# EAGLE design brewBuddy (EAGLE 7.5.0)
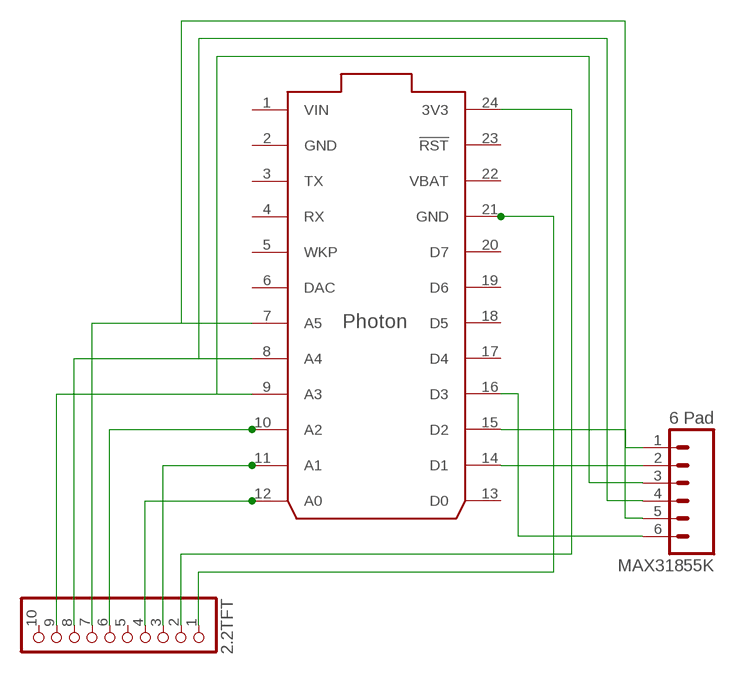
[diagram p0: schematic, sheet 1]

## Parts
2.2TFT  MICROBUILDER_HEADER-1X101X10_2MM  [MICROBUILDER_1X10_ROUND_2MM]
MAX31855K  6 Pad  M06LONGPADS  [1X06_LONGPADS]
U$1  PHOTON_WITH_HEADERS  [PHOTON]

## Nets
N$1: MAX31855K.1 U$1.15(D2)
N$2: MAX31855K.2 U$1.14(D1)
N$3: MAX31855K.6 U$1.16(D3)
N$4: 2.2TFT.9 MAX31855K.3 U$1.9(A3)
N$5: 2.2TFT.8 MAX31855K.4 U$1.8(A4)
N$6: 2.2TFT.7 MAX31855K.5 U$1.7(A5)
N$9: 2.2TFT.6 U$1.10(A2)
N$10: 2.2TFT.4 U$1.12(A0)
N$11: 2.2TFT.3 U$1.11(A1)
N$12: 2.2TFT.2 U$1.24(3V3)
N$13: 2.2TFT.1 U$1.21(GND)
Unconnected: 2.2TFT.5 2.2TFT.10 U$1.3(TX) U$1.4(RX) U$1.5(WKP) U$1.6(DAC) U$1.13(D0) U$1.17(D4) U$1.18(D5) U$1.19(D6) U$1.20(D7) U$1.23(!RST)

## Power pins joined to a net without a drawn wire
GND: U$1.2(GND)
VBAT: U$1.22(VBAT)
VIN: U$1.1(VIN)

## Library data of the parts
2.2TFT = Adafruit_2.2_SPI_240x320:MICROBUILDER_HEADER-1X10: PIN HEADER
MAX31855K = SparkFun_Thermocouple_Breakout:M06: Header 6 Standard 6-pin 0.1" header. Use with straight break away headers (SKU : PRT-00116), right angle break away headers (PRT-00553), swiss pins (PRT-00743), machine pins (PRT-00117), and female headers (PRT-00115). Molex polarized connector foot print use with SKU : PRT-08094 with associated crimp pins and housings. NOTES ON THE VARIANTS LOCK and LOCK_LONGPADS... This footprint was designed to help hold the alignment of a through-hole component (i.e. 6-pin header) while soldering it into place. You may notice that each hole has been shifted either up or down by 0.005 of an inch from it's more standard position (which is a perfectly straight line). This slight alteration caused the pins (the squares in the middle) to touch the edges of the holes. Because they are alternating, it causes a "brace" to hold the component in place. 0.005 has proven to be the perfect amount of "off-center" position when using our standard breakaway headers. Although looks a little odd when you look at the bare footprint, once you have a header in there, the alteration is very hard to notice. Also,if you push a header all the way into place, it is covered up entirely on the bottom side. This idea of altering the position of holes to aid alignment will be further integrated into the Sparkfun Library for other footprints. It can help hold any component with 3 or more connection pins.
U$1 = Spark:PHOTON

## Board
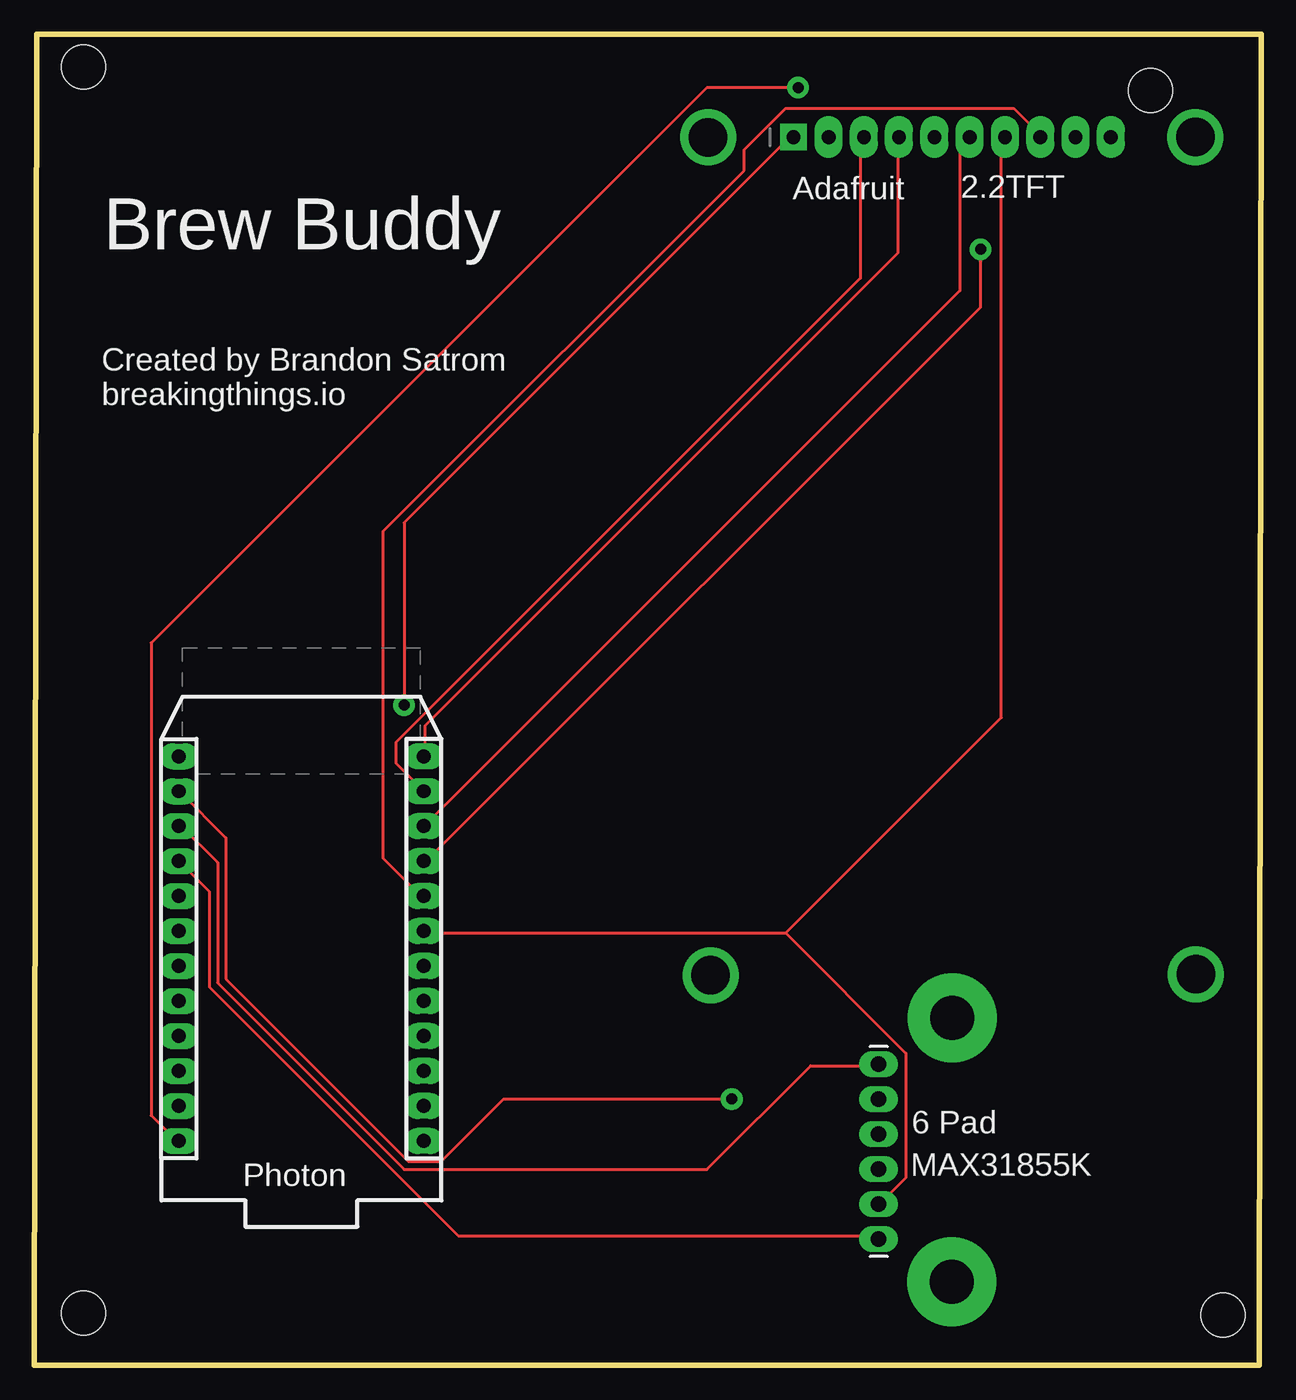
[diagram p1: board, top side]
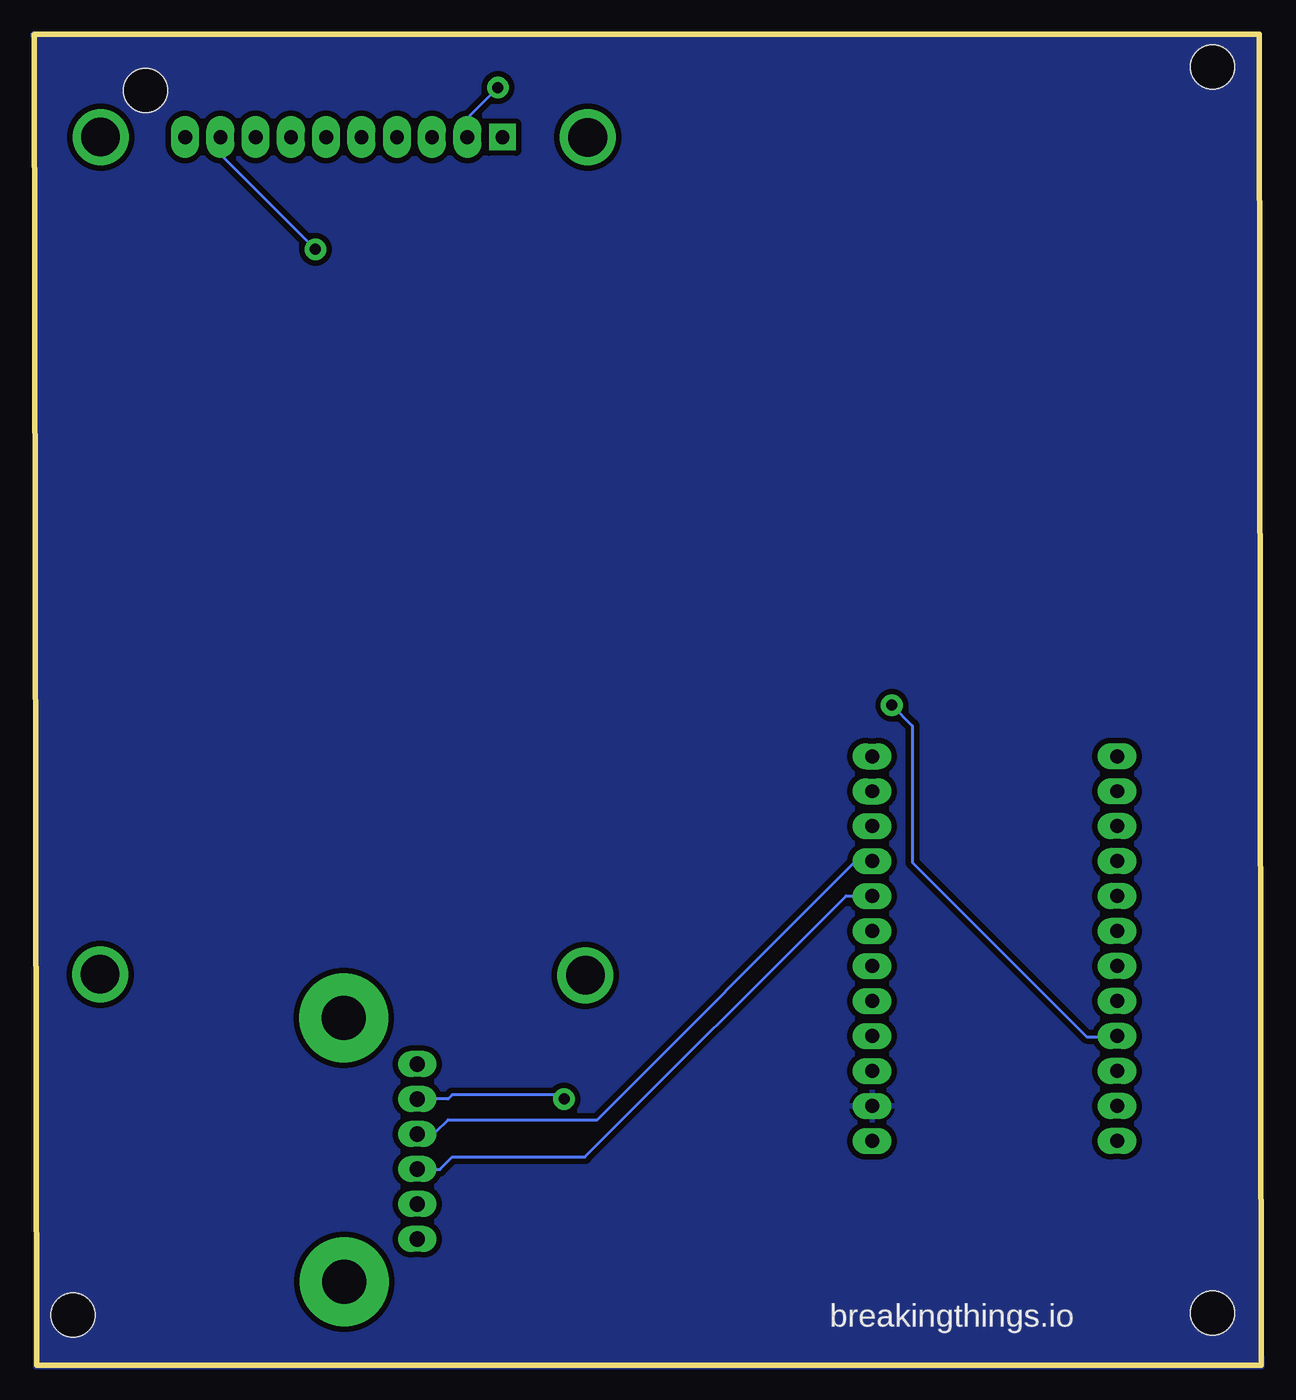
[diagram p2: board, bottom side, seen from below]

Size 89.07 x 96.62 mm. Coordinates in mm from the lower left corner, seen from the top.
Outline: 0,0 0.17,96.62 89.07,96.62 88.9,0 0,0
Copper layers (1*16): Top 0.035mm / dielectric 1.5mm / Bottom 0.035mm
Design rules "Othermill-DRC-1-64 *": minimum track width 8mil, minimum drill 0.8mm, track to track 0.39878125mm, track to pad 0.39878125mm, pad to pad 0.39878125mm, via to via 0.39878125mm, smd to smd 0mil, copper to edge 0mil, drill to drill 1mil, minimum pad ring 15mil, minimum via ring 15mil, stop-mask expansion 1mil, vias tented up to drill 30mil, thermal gap 10mil
Holes 3.2 mm at 3.56,94.25 3.56,3.78 86.28,3.64 81.02,92.57

### Footprints (pad centres in the part's own frame; a part is rotated, then mirrored left to right if it is on the bottom)
MICROBUILDER_1X10_ROUND_2MM = drill 1 pad 1.93 square: 1 -10,0 | drill 1 pad 2.032 long: 2 -7.44,0; 3 -4.88,0; 4 -2.34,0; 5 0.24,0; 6 2.8,0; 7 5.36,0; 8 7.92,0; 9 10.48,0; 10 13.04,0
1X06_LONGPADS = drill 1.118 pad 1.88 long: 1 0,0; 2 2.54,0; 3 5.08,0; 4 7.62,0; 5 10.16,0; 6 12.7,0
PHOTON = drill 1.016 pad 1.88 long: 1 1.27,32.258; 2 1.27,29.718; 3 1.27,27.178; 4 1.27,24.638; 5 1.27,22.098; 6 1.27,19.558; 7 1.27,17.018; 8 1.27,14.478; 9 1.27,11.938; 10 1.27,9.398; 11 1.27,6.858; 12 1.27,4.318; 13 19.05,4.318; 14 19.05,6.858; 15 19.05,9.398; 16 19.05,11.938; 17 19.05,14.478; 18 19.05,17.018; 19 19.05,19.558; 20 19.05,22.098; 21 19.05,24.638; 22 19.05,27.178; 23 19.05,29.718; 24 19.05,32.258

### Placement (x,y rotation side)
2.2TFT  65.09,89.17 0 top
MAX31855K  61.28,21.86 270 top
U$1  29.53,48.53 180 top

### Tracks (layer width: path | path; a pad name or v marks a point on that pad's centre or on a via)
GND
  pour Bottom: 0.15,96.65 89.15,96.65 89.15,96.48 88.98,96.48 88.98,-0.13 -0.02,-0.13 -0.02,0.62 0.15,0.62
N$1
  Top 0.203: MAX31855K.1 61.15,21.73 56.33,21.73 48.81,14.21 26.84,14.21 13.29,27.75 13.29,36.48 10.58,39.19 U$1.15
N$2  (via drill 0.8)
  Top 0.203: v50.62,19.33 34.06,19.33 29.55,14.81 27.14,14.81 13.9,28.05 13.9,38.29 10.58,41.6 U$1.14
  Bottom 0.203: v50.62,19.33 50.92,19.63 58.74,19.63 59.04,19.33 61.15,19.33 MAX31855K.2
N$3
  Top 0.203: MAX31855K.6 61.15,9.39 30.75,9.39 12.69,27.45 12.69,34.38 10.58,36.48 U$1.16
N$4  (via drill 0.8)
  Top 0.203: v68.68,81.03 68.68,76.82 28.34,36.48 U$1.9
  Bottom 0.203: U$1.9 28.34,36.48 29.55,36.48 48.21,17.82 59.04,17.82 59.95,16.92 61.15,16.92 MAX31855K.3 | v68.68,81.03 75.3,87.65 75.3,89.16 2.2TFT.9
N$5
  Top 0.203: 2.2TFT.8 72.89,89.46 71.08,91.26 54.53,91.26 51.52,88.25 51.52,86.75 25.33,60.56 25.33,36.78 28.04,34.07 U$1.8
  Bottom 0.203: U$1.8 28.34,34.07 30.15,34.07 49.11,15.11 58.74,15.11 59.65,14.21 61.15,14.21 MAX31855K.4
N$6
  Top 0.203: 54.53,31.37 63.26,22.64 63.26,13.61 61.45,11.8 MAX31855K.5 | 54.53,31.37 28.34,31.37 U$1.7 | 54.53,31.37 70.18,47.02 70.18,89.16 2.2TFT.7
N$9
  Top 0.203: U$1.10 28.34,39.19 67.17,78.02 67.17,88.55 67.77,89.16 2.2TFT.6
N$10
  Top 0.203: U$1.12 28.34,44.31 28.34,46.42 62.66,80.73 62.66,89.16 2.2TFT.4
N$11
  Top 0.203: U$1.11 28.04,41.9 26.24,43.71 26.24,45.21 59.95,78.92 59.95,89.16 2.2TFT.3
N$12  (via drill 0.8)
  Top 0.203: v55.43,92.77 48.81,92.77 8.48,52.44 8.48,18.12 10.28,16.32 U$1.24
  Bottom 0.203: v55.43,92.77 57.54,90.66 57.54,89.46 2.2TFT.2
N$13  (via drill 0.8)
  Top 0.203: v26.84,47.92 26.84,61.16 54.83,89.16 2.2TFT.1
  Bottom 0.203: v26.84,47.92 25.33,46.42 25.33,36.48 12.69,23.84 10.58,23.84 U$1.21
N$21  (via drill 2.8 pad 2.54)
  other vias: 48.91,89.15
N$22  (via drill 2.8 pad 2.54)
  other vias: 84.27,89.17
N$23  (via drill 2.8 pad 2.54)
  other vias: 49.08,28.3
N$24  (via drill 2.8 pad 2.54)
  other vias: 84.3,28.37
N$25  (via drill 3.2 pad 6.45)
  other vias: 66.58,6.05
N$26  (via drill 3.2 pad 6.45)
  other vias: 66.61,25.2

### Text on the board
tPlace: Adafruit | Brew Buddy | Created by Brandon Satrom / breakingthings.io | Photon
bPlace: breakingthings.io